# Altium schematic sheet BarGraph.SchDoc
size A
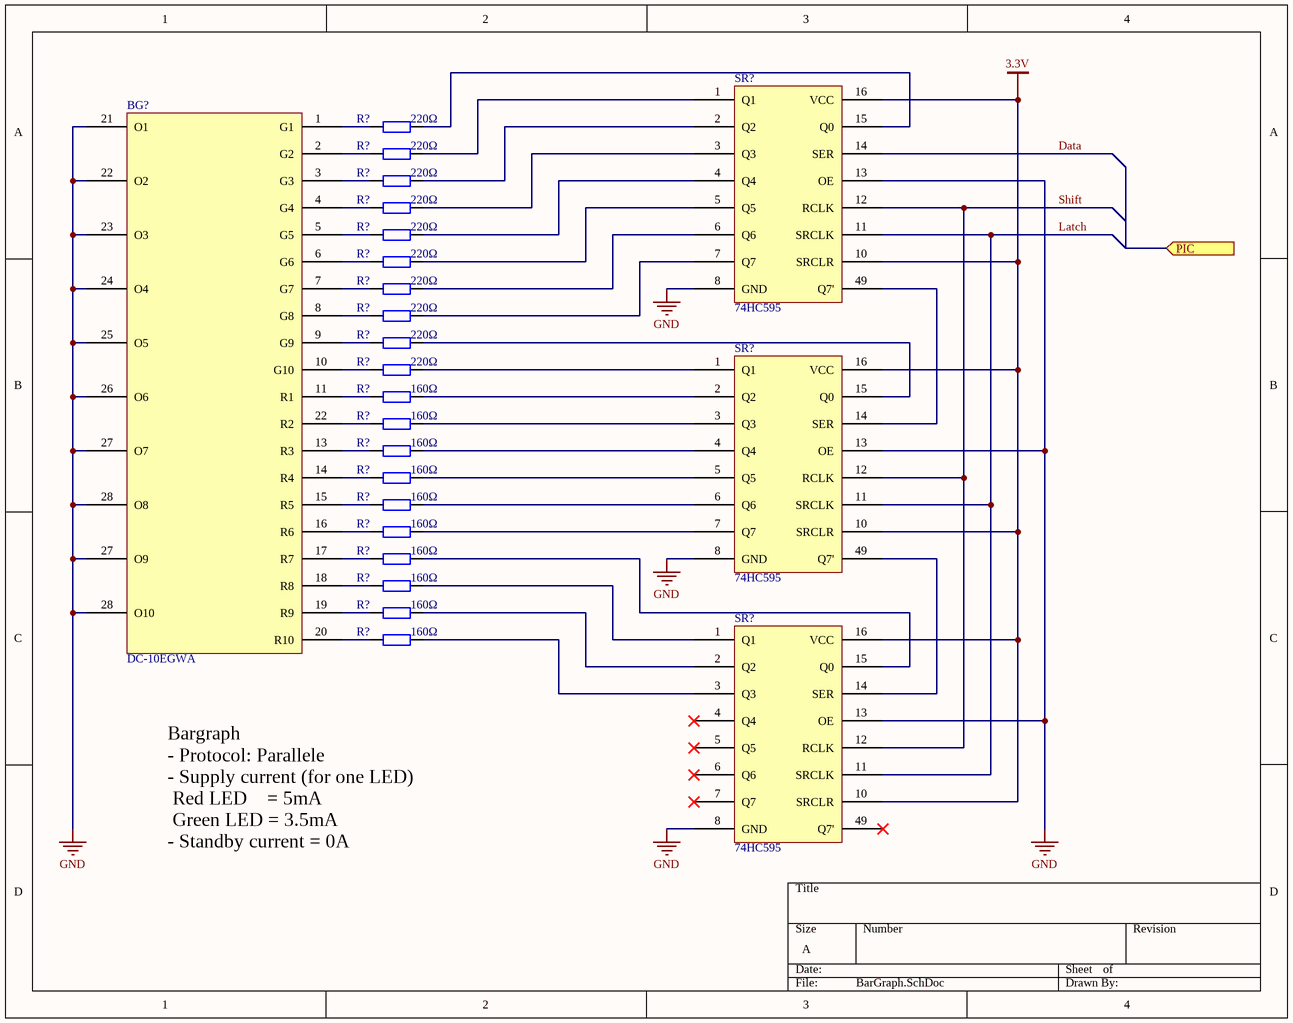
[diagram p0: BarGraph.SchDoc]

## Parts
(Parts that share a designator on the sheet are numbered #1, #2 ... from top to bottom, then left to right.)
BG?  DC-10EGWA
R?#1  220Ω  [AXIAL-0.4]
R?#2  220Ω  [AXIAL-0.4]
R?#3  220Ω  [AXIAL-0.4]
R?#4  220Ω  [AXIAL-0.4]
R?#5  220Ω  [AXIAL-0.4]
R?#6  220Ω  [AXIAL-0.4]
R?#7  220Ω  [AXIAL-0.4]
R?#8  220Ω  [AXIAL-0.4]
R?#9  220Ω  [AXIAL-0.4]
R?#10  220Ω  [AXIAL-0.4]
R?#11  160Ω  [AXIAL-0.4]
R?#12  160Ω  [AXIAL-0.4]
R?#13  160Ω  [AXIAL-0.4]
R?#14  160Ω  [AXIAL-0.4]
R?#15  160Ω  [AXIAL-0.4]
R?#16  160Ω  [AXIAL-0.4]
R?#17  160Ω  [AXIAL-0.4]
R?#18  160Ω  [AXIAL-0.4]
R?#19  160Ω  [AXIAL-0.4]
R?#20  160Ω  [AXIAL-0.4]
SR?#1  74HC595
SR?#2  74HC595
SR?#3  74HC595

## Ports
PIC (in)

## Nets
3.3V: SR?#1.10(SRCLR) SR?#1.16(VCC) SR?#2.10(SRCLR) SR?#2.16(VCC) SR?#3.10(SRCLR) SR?#3.16(VCC)
GND: BG?.21(O1) BG?.22(O2) BG?.23(O3) BG?.24(O4) BG?.25(O5) BG?.26(O6) BG?.27(O7) BG?.28(O8) SR?#1.8(GND) SR?#1.13(OE) SR?#2.8(GND) SR?#2.13(OE) SR?#3.8(GND) SR?#3.13(OE)
Data: SR?#1.14(SER)
Latch: SR?#1.11(SRCLK) SR?#2.11(SRCLK) SR?#3.11(SRCLK)
Shift: SR?#1.12(RCLK) SR?#2.12(RCLK) SR?#3.12(RCLK)
NetBG?_1: BG?.1(G1) R?#1.1
NetBG?_2: BG?.2(G2) R?#2.1
NetBG?_3: BG?.3(G3) R?#3.1
NetBG?_4: BG?.4(G4) R?#4.1
NetBG?_5: BG?.5(G5) R?#5.1
NetBG?_6: BG?.6(G6) R?#6.1
NetBG?_7: BG?.7(G7) R?#7.1
NetBG?_8: BG?.8(G8) R?#8.1
NetBG?_9: BG?.9(G9) R?#9.1
NetBG?_10: BG?.10(G10) R?#10.1
NetBG?_11: BG?.11(R1) R?#11.1
NetBG?_13: BG?.13(R3) R?#13.1
NetBG?_14: BG?.14(R4) R?#14.1
NetBG?_15: BG?.15(R5) R?#15.1
NetBG?_16: BG?.16(R6) R?#16.1
NetBG?_17: BG?.17(R7) R?#17.1
NetBG?_18: BG?.18(R8) R?#18.1
NetBG?_19: BG?.19(R9) R?#19.1
NetBG?_20: BG?.20(R10) R?#20.1
NetBG?_22: BG?.22(R2) R?#12.1
NetR?#1_2: R?#1.2 SR?#1.15(Q0)
NetR?#2_2: R?#2.2 SR?#1.1(Q1)
NetR?#3_2: R?#3.2 SR?#1.2(Q2)
NetR?#4_2: R?#4.2 SR?#1.3(Q3)
NetR?#5_2: R?#5.2 SR?#1.4(Q4)
NetR?#6_2: R?#6.2 SR?#1.5(Q5)
NetR?#7_2: R?#7.2 SR?#1.6(Q6)
NetR?#8_2: R?#8.2 SR?#1.7(Q7)
NetR?#9_2: R?#9.2 SR?#2.15(Q0)
NetR?#10_2: R?#10.2 SR?#2.1(Q1)
NetR?#11_2: R?#11.2 SR?#2.2(Q2)
NetR?#12_2: R?#12.2 SR?#2.3(Q3)
NetR?#13_2: R?#13.2 SR?#2.4(Q4)
NetR?#14_2: R?#14.2 SR?#2.5(Q5)
NetR?#15_2: R?#15.2 SR?#2.6(Q6)
NetR?#16_2: R?#16.2 SR?#2.7(Q7)
NetR?#17_2: R?#17.2 SR?#3.15(Q0)
NetR?#18_2: R?#18.2 SR?#3.1(Q1)
NetR?#19_2: R?#19.2 SR?#3.2(Q2)
NetR?#20_2: R?#20.2 SR?#3.3(Q3)
NetSR?#1_49: SR?#1.49(Q7') SR?#2.14(SER)
NetSR?#2_49: SR?#2.49(Q7') SR?#3.14(SER)

Not connected (* = marked no-connect by the designer): SR?#3 4(Q4)* 5(Q5)* 6(Q6)* 7(Q7)* 49(Q7')*

## Notes on the sheet
- Bargraph
  - Protocol: Parallele
  - Supply current (for one LED)
  Red LED    = 5mA
  Green LED = 3.5mA
  - Standby current = 0A

## Library data of the parts
BG? SR?#1-SR?#3 = Component_1
R?#1-R?#20 = Res2: Resistor; Value: 1K; Published: 8-Jun-2000; LatestRevisionDate: 17-Jul-2002; LatestRevisionNote: Re-released for DXP Platform.; PackageReference: AXIAL-0.4; Publisher: Altium Limited; PackageDescription: Axial Device, Thru-Hole; 2 Leads; 0.4 in Pin Spacing